# EAGLE design icsp_adapter (EAGLE 7.5.0)
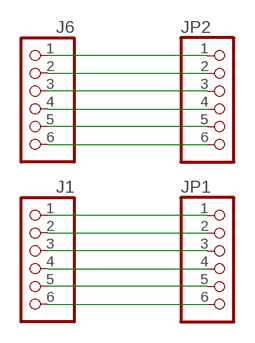
[diagram p0: schematic, sheet 1]

## Parts
J1  PH1X650MIL  [PH1X6_50MIL]
J6  PH1X650MIL  [PH1X6_50MIL]
JP1  PINHD-1X6  [1X06]
JP2  PINHD-1X6  [1X06]

## Nets
N$1: J6.1 JP2.1
N$2: J6.2 JP2.2
N$3: J6.3 JP2.3
N$4: J6.4 JP2.4
N$5: J6.5 JP2.5
N$6: J6.6 JP2.6
N$7: J1.1 JP1.1
N$8: J1.2 JP1.2
N$9: J1.3 JP1.3
N$10: J1.4 JP1.4
N$11: J1.5 JP1.5
N$12: J1.6 JP1.6

## Library data of the parts
J1 J6 = MY_CONN:PH1X6
JP1 JP2 = pinhead:PINHD-1X6: PIN HEADER

## Board
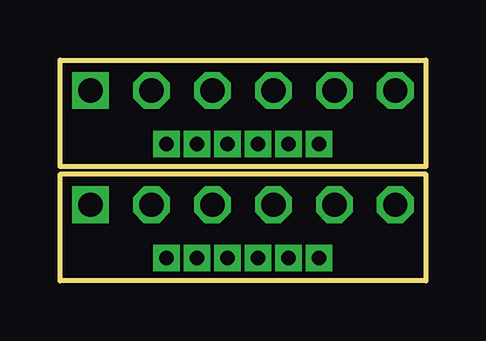
[diagram p1: board, top side]
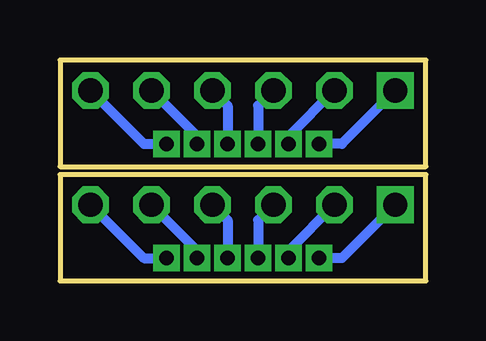
[diagram p2: board, bottom side, seen from below]

Size 15.24 x 9.21 mm. Coordinates in mm from the lower left corner, seen from the top.
Outline: 15.24,4.76 0,4.76 0,9.21 15.24,9.21 15.24,4.76
Outline: 15.24,4.44 0,4.44 0,0 15.24,0 15.24,4.44
Copper layers (1*16): Top 0.035mm / dielectric 1.5mm / Bottom 0.035mm
Design rules "default": minimum track width 10mil, minimum drill 24mil, track to track 8mil, track to pad 8mil, pad to pad 8mil, via to via 8mil, smd to smd 8mil, copper to edge 40mil, drill to drill 8mil, minimum pad ring 10mil, minimum via ring 8mil, stop-mask expansion 4mil, vias tented up to drill 0mil, thermal gap 10mil

### Footprints (pad centres in the part's own frame; a part is rotated, then mirrored left to right if it is on the bottom)
PH1X6_50MIL = drill 0.6 pad 0.889 square: 1 0,0; 2 0,-1.27; 3 0,-2.54; 4 0,-3.81; 5 0,-5.08; 6 0,-6.35
1X06 = drill 1.016 square: 1 -6.35,0 | drill 1.016 octagon: 2 -3.81,0; 3 -1.27,0; 4 1.27,0; 5 3.81,0; 6 6.35,0

### Placement (x,y rotation side)
J1  4.45,0.95 90 top
J6  4.45,5.71 90 top
JP1  7.62,3.17 0 top
JP2  7.62,7.94 0 top

### Tracks (layer width: path | path; a pad name or v marks a point on that pad's centre or on a via)
N$1
  Bottom 0.406: JP2.1 3.49,5.71 J6.1
N$2
  Bottom 0.406: JP2.2 5.71,6.03 J6.2
N$3
  Bottom 0.406: JP2.3 6.99,7.3 J6.3
N$4
  Bottom 0.406: JP2.4 8.26,7.3 J6.4
N$5
  Bottom 0.406: JP2.5 9.53,6.03 J6.5
N$6
  Bottom 0.406: JP2.6 11.75,5.71 J6.6
N$7
  Bottom 0.406: JP1.1 3.49,0.95 J1.1
N$8
  Bottom 0.406: JP1.2 5.71,1.27 J1.2
N$9
  Bottom 0.406: JP1.3 6.99,2.54 J1.3
N$10
  Bottom 0.406: JP1.4 8.26,2.54 J1.4
N$11
  Bottom 0.406: JP1.5 9.53,1.27 J1.5
N$12
  Bottom 0.406: JP1.6 11.75,0.95 J1.6